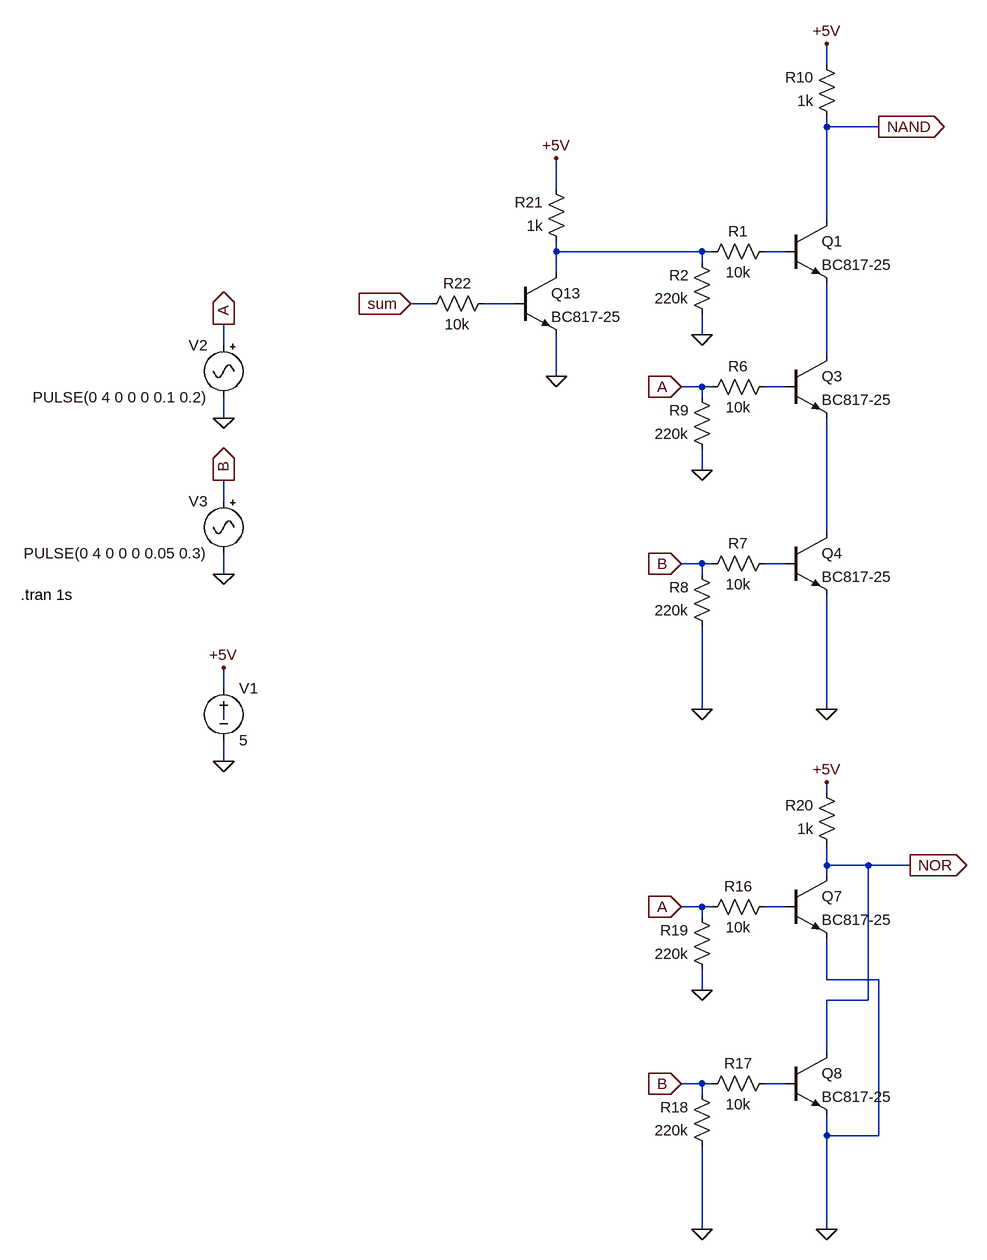
[diagram p0: schematic overflow.asc]
overflow.asc, the LTspice schematic file:
Version 4
SHEET 1 3012 1972
WIRE 672 -480 672 -512
WIRE 672 -384 672 -400
WIRE 752 -384 672 -384
WIRE 256 -288 256 -336
WIRE 672 -240 672 -384
WIRE 256 -192 256 -208
WIRE 480 -192 256 -192
WIRE 496 -192 480 -192
WIRE 608 -192 576 -192
WIRE 480 -176 480 -192
WIRE 256 -160 256 -192
WIRE 64 -112 32 -112
WIRE 192 -112 144 -112
WIRE 480 -64 480 -96
WIRE -256 -48 -256 -80
WIRE 672 -32 672 -144
WIRE 256 0 256 -64
WIRE 480 16 448 16
WIRE 496 16 480 16
WIRE 608 16 576 16
WIRE 480 32 480 16
WIRE -256 64 -256 32
WIRE 480 144 480 112
WIRE -256 192 -256 160
WIRE 672 240 672 64
WIRE 480 288 448 288
WIRE 496 288 480 288
WIRE 608 288 576 288
WIRE -256 304 -256 272
WIRE 480 304 480 288
WIRE -256 480 -256 448
WIRE 480 512 480 384
WIRE 672 512 672 336
WIRE -256 528 -256 512
WIRE -256 592 -256 560
WIRE 672 640 672 624
WIRE 672 752 672 720
WIRE 736 752 672 752
WIRE 800 752 736 752
WIRE 672 768 672 752
WIRE 480 816 448 816
WIRE 496 816 480 816
WIRE 608 816 576 816
WIRE 480 832 480 816
WIRE 672 928 672 864
WIRE 752 928 672 928
WIRE 480 944 480 912
WIRE 736 960 736 752
WIRE 736 960 672 960
WIRE 672 1040 672 960
WIRE 480 1088 448 1088
WIRE 496 1088 480 1088
WIRE 608 1088 576 1088
WIRE 480 1104 480 1088
WIRE 672 1168 672 1136
WIRE 752 1168 752 928
WIRE 752 1168 672 1168
WIRE 480 1312 480 1184
WIRE 672 1312 672 1168
FLAG -256 592 0
FLAG -256 64 0
FLAG -256 304 0
FLAG -256 448 +5V
FLAG -256 -80 A
IOPIN -256 -80 Out
FLAG -256 160 B
IOPIN -256 160 Out
FLAG 672 512 0
FLAG 480 144 0
FLAG 480 512 0
FLAG 256 -336 +5V
FLAG 448 16 A
IOPIN 448 16 In
FLAG 448 288 B
IOPIN 448 288 In
FLAG 752 -384 NAND
IOPIN 752 -384 Out
FLAG 672 1312 0
FLAG 480 944 0
FLAG 480 1312 0
FLAG 672 624 +5V
FLAG 448 816 A
IOPIN 448 816 In
FLAG 448 1088 B
IOPIN 448 1088 In
FLAG 800 752 NOR
IOPIN 800 752 Out
FLAG 256 0 0
FLAG 32 -112 sum
IOPIN 32 -112 In
FLAG 672 -512 +5V
FLAG 480 -64 0
SYMBOL voltage -256 464 R0
WINDOW 123 0 0 Left 2
WINDOW 39 0 0 Left 2
SYMATTR InstName V1
SYMATTR Value 5
SYMBOL Misc\\signal -256 -64 M0
WINDOW 123 0 0 Left 2
WINDOW 39 0 0 Left 2
SYMATTR InstName V2
SYMATTR Value PULSE(0 4 0 0 0 0.1 0.2)
SYMBOL Misc\\signal -256 176 M0
WINDOW 123 0 0 Left 2
WINDOW 39 0 0 Left 2
SYMATTR InstName V3
SYMATTR Value PULSE(0 4 0 0 0 0.05 0.3)
SYMBOL npn 608 -32 R0
SYMATTR InstName Q3
SYMATTR Value BC817-25
SYMBOL npn 608 240 R0
SYMATTR InstName Q4
SYMATTR Value BC817-25
SYMBOL res 592 0 R90
WINDOW 0 0 56 VBottom 2
WINDOW 3 32 56 VTop 2
SYMATTR InstName R6
SYMATTR Value 10k
SYMBOL res 592 272 R90
WINDOW 0 0 56 VBottom 2
WINDOW 3 32 56 VTop 2
SYMATTR InstName R7
SYMATTR Value 10k
SYMBOL res 496 400 R180
WINDOW 0 36 76 Left 2
WINDOW 3 36 40 Left 2
SYMATTR InstName R8
SYMATTR Value 220k
SYMBOL res 496 128 R180
WINDOW 0 36 76 Left 2
WINDOW 3 36 40 Left 2
SYMATTR InstName R9
SYMATTR Value 220k
SYMBOL res 688 -384 R180
WINDOW 0 36 76 Left 2
WINDOW 3 36 40 Left 2
SYMATTR InstName R10
SYMATTR Value 1k
SYMBOL npn 608 768 R0
SYMATTR InstName Q7
SYMATTR Value BC817-25
SYMBOL npn 608 1040 R0
SYMATTR InstName Q8
SYMATTR Value BC817-25
SYMBOL res 592 800 R90
WINDOW 0 0 56 VBottom 2
WINDOW 3 32 56 VTop 2
SYMATTR InstName R16
SYMATTR Value 10k
SYMBOL res 592 1072 R90
WINDOW 0 0 56 VBottom 2
WINDOW 3 32 56 VTop 2
SYMATTR InstName R17
SYMATTR Value 10k
SYMBOL res 496 1200 R180
WINDOW 0 36 76 Left 2
WINDOW 3 36 40 Left 2
SYMATTR InstName R18
SYMATTR Value 220k
SYMBOL res 496 928 R180
WINDOW 0 36 76 Left 2
WINDOW 3 36 40 Left 2
SYMATTR InstName R19
SYMATTR Value 220k
SYMBOL res 688 736 R180
WINDOW 0 36 76 Left 2
WINDOW 3 36 40 Left 2
SYMATTR InstName R20
SYMATTR Value 1k
SYMBOL npn 192 -160 R0
SYMATTR InstName Q13
SYMATTR Value BC817-25
SYMBOL res 272 -192 R180
WINDOW 0 36 76 Left 2
WINDOW 3 36 40 Left 2
SYMATTR InstName R21
SYMATTR Value 1k
SYMBOL res 160 -128 R90
WINDOW 0 0 56 VBottom 2
WINDOW 3 32 56 VTop 2
SYMATTR InstName R22
SYMATTR Value 10k
SYMBOL npn 608 -240 R0
SYMATTR InstName Q1
SYMATTR Value BC817-25
SYMBOL res 592 -208 R90
WINDOW 0 0 56 VBottom 2
WINDOW 3 32 56 VTop 2
SYMATTR InstName R1
SYMATTR Value 10k
SYMBOL res 496 -80 R180
WINDOW 0 36 76 Left 2
WINDOW 3 36 40 Left 2
SYMATTR InstName R2
SYMATTR Value 220k
TEXT -568 336 Left 2 !.tran 1s

The netlist it stands for:
* overflow.asc
V1 +5V 0 5
V2 A 0 PULSE(0 4 0 0 0 0.1 0.2)
V3 B 0 PULSE(0 4 0 0 0 0.05 0.3)
Q3 N004 N005 N006 0 BC817-25
Q4 N006 N007 0 0 BC817-25
R6 N005 A 10k
R7 N007 B 10k
R8 0 B 220k
R9 0 A 220k
R10 NAND +5V 1k
Q7 NOR N009 0 0 BC817-25
Q8 NOR N010 0 0 BC817-25
R16 N009 A 10k
R17 N010 B 10k
R18 0 B 220k
R19 0 A 220k
R20 NOR +5V 1k
Q13 N001 N003 0 0 BC817-25
R21 N001 +5V 1k
R22 N003 sum 10k
Q1 NAND N002 N004 0 BC817-25
R1 N002 N001 10k
R2 0 N001 220k
.model NPN NPN
.model PNP PNP
.lib standard.bjt
.tran 1s
.backanno
.end